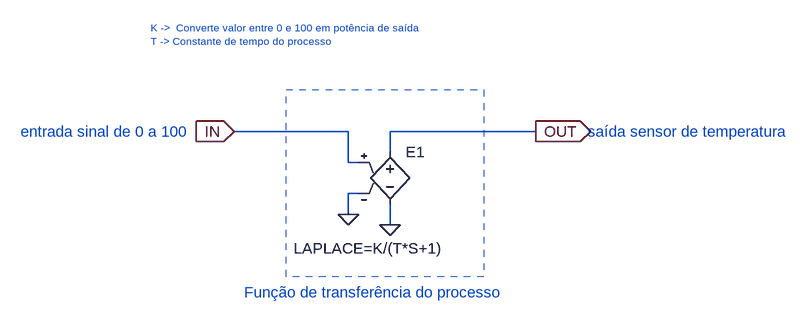
[diagram p0: schematic TF.asc]
TF.asc, the LTspice schematic file:
Version 4
SHEET 1 1216 680
WIRE 176 160 0 160
WIRE 464 160 240 160
WIRE 240 192 240 160
WIRE 176 208 176 160
WIRE 192 208 176 208
WIRE 192 256 176 256
WIRE 176 288 176 256
WIRE 240 304 240 272
FLAG 0 160 IN
IOPIN 0 160 In
FLAG 464 160 OUT
IOPIN 464 160 Out
FLAG 240 304 0
FLAG 176 288 0
SYMBOL e 240 176 R0
WINDOW 3 -148 164 Left 2
SYMATTR Value LAPLACE=K/(T*S+1)
SYMATTR InstName E1
TEXT -328 160 Left 2 ;entrada sinal de 0 a 100
TEXT 544 160 Left 2 ;saída sensor de temperatura
TEXT 16 408 Left 2 ;Função de transferência do processo
TEXT -128 0 Left 1 ;K ->  Converte valor entre 0 e 100 em potência de saída\nT -> Constante de tempo do processo
RECTANGLE Normal 384 384 80 96 2

The netlist it stands for:
* TF.asc
E1 OUT 0 IN 0 LAPLACE=K/(T*S+1)
* entrada sinal de 0 a 100
* saída sensor de temperatura
* Função de transferência do processo
* K ->  Converte valor entre 0 e 100 em potência de saída
* T -> Constante de tempo do processo
.backanno
.end